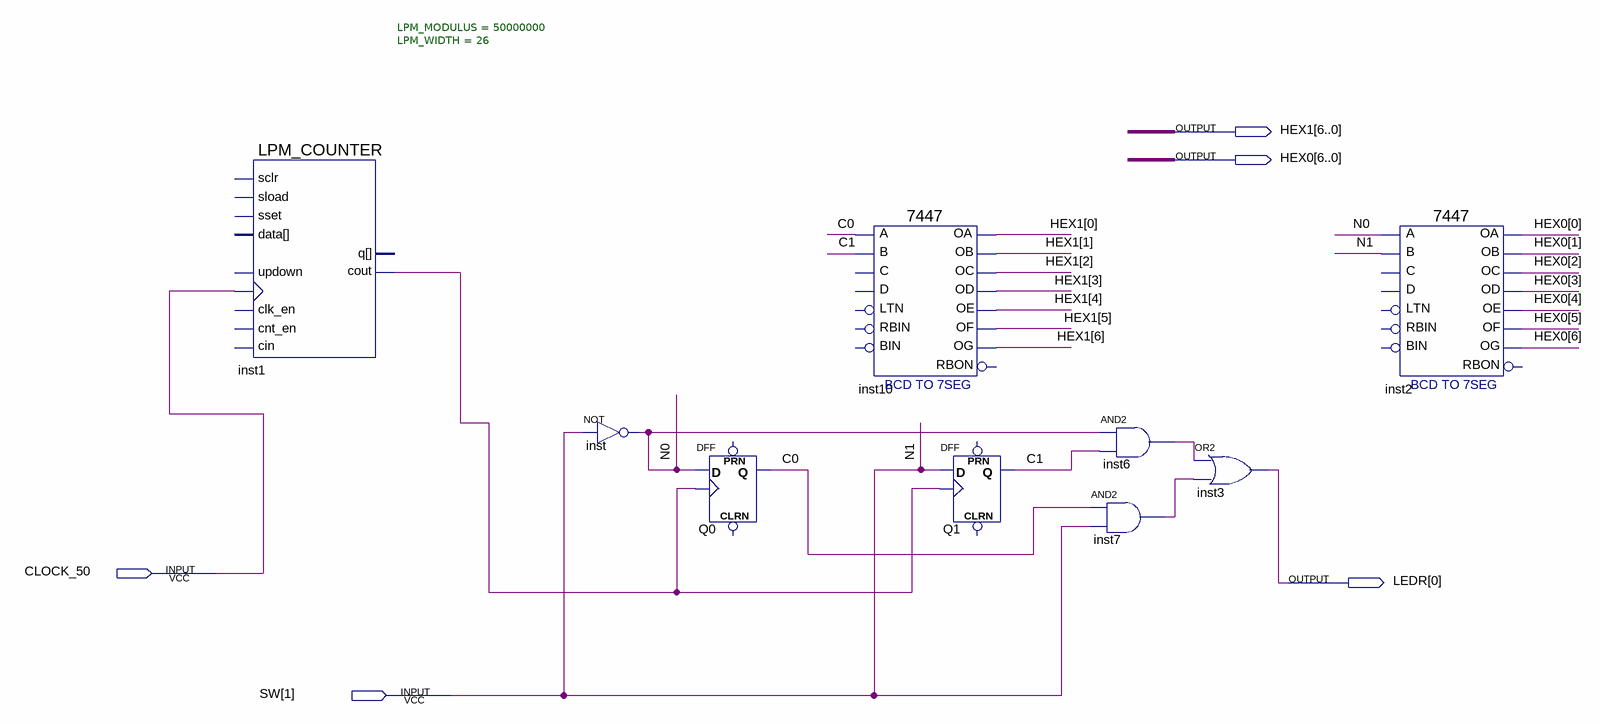
[diagram p0: schematic sheet]
// Quartus schematic 22521154_mearly.bdf as structural Verilog: 9 symbols, 5 pins
module \22521154_mearly  (
  input  CLOCK_50,
  input  [1:1] SW,
  output [6:0] HEX1,
  output [6:0] HEX0,
  output [0:0] LEDR
);

  wire C0, C1, inst1_cout, inst6_out, inst7_out, N0;

  LPM_COUNTER #(.LPM_MODULUS(50000000), .LPM_WIDTH(26)) inst1 (
    .clock(CLOCK_50), .cout(inst1_cout));  // open: cin, clk_en, cnt_en, data, sclr, sload, sset, updown, q
  not inst (N0, SW[1]);
  DFF Q0 (.CLK(inst1_cout), .D(N0), .Q(C0));  // open: CLRN, PRN
  \7447  inst10 (
    .B(C1), .A(C0), .OB(HEX1[1]), .OC(HEX1[2]), .OE(HEX1[4]), .OD(HEX1[3]), .OF(HEX1[5]), .OG(HEX1[6]),
    .OA(HEX1[0]));  // open: LTN, C, D, RBIN, BIN, RBON
  DFF Q1 (.CLK(inst1_cout), .D(SW[1]), .Q(C1));  // open: CLRN, PRN
  and inst7 (inst7_out, C0, SW[1]);
  and inst6 (inst6_out, N0, C1);
  or inst3 (LEDR[0], inst6_out, inst7_out);
  \7447  inst2 (
    .B(SW[1]), .A(N0), .OB(HEX0[1]), .OC(HEX0[2]), .OE(HEX0[4]), .OD(HEX0[3]), .OF(HEX0[5]), .OG(HEX0[6]),
    .OA(HEX0[0]));  // open: LTN, C, D, RBIN, BIN, RBON

  // Other names for the same wires on the sheet: N1 = SW[1]
endmodule
